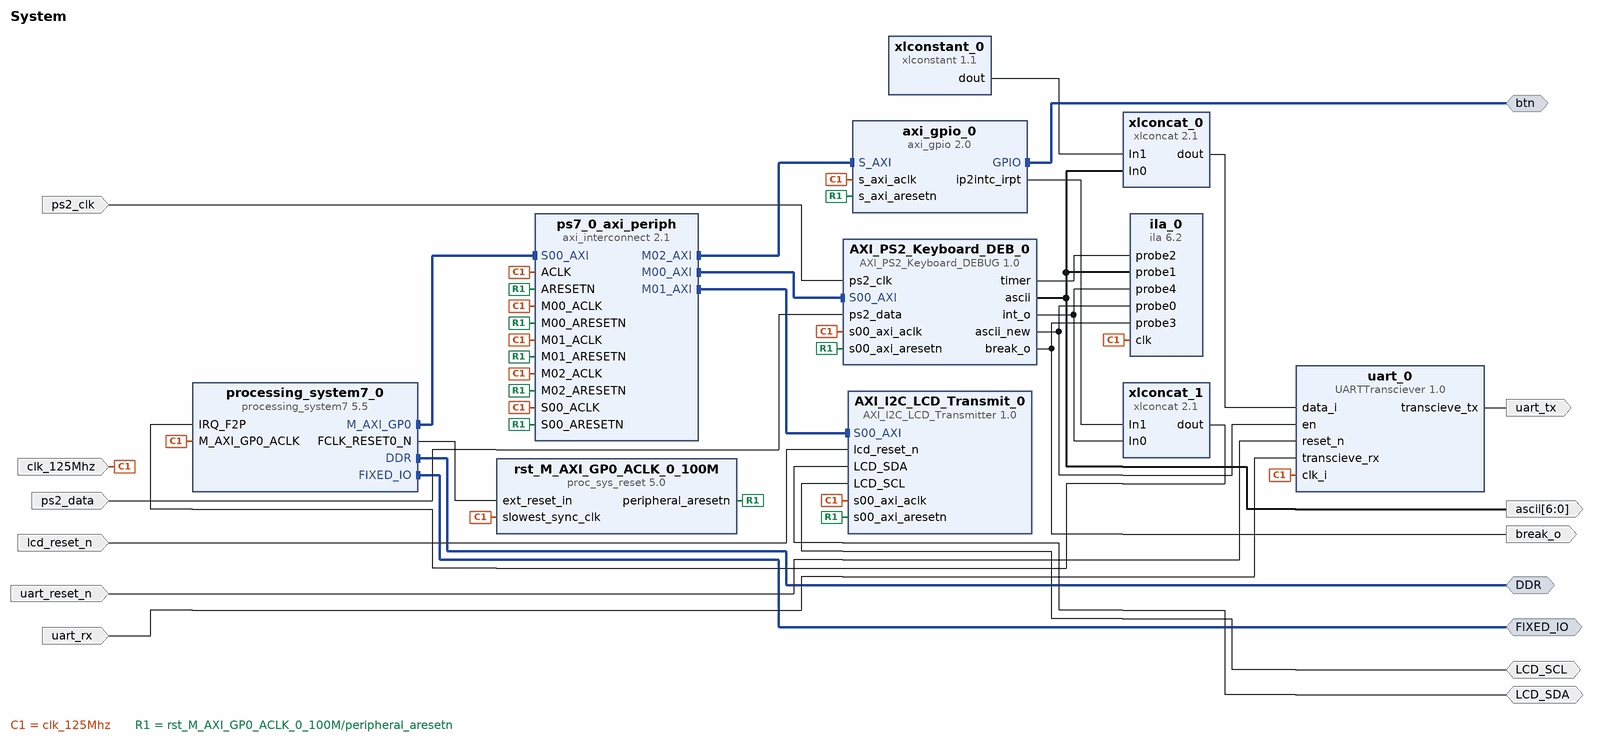
[diagram p0: block diagram of the top level]
# Vivado block design System, xc7z020clg400-1, Vivado 2022.1.2
create_bd_design System

create_bd_intf_port -mode Master -vlnv xilinx.com:interface:ddrx_rtl:1.0 DDR
create_bd_intf_port -mode Master -vlnv xilinx.com:display_processing_system7:fixedio_rtl:1.0 FIXED_IO
create_bd_intf_port -mode Master -vlnv xilinx.com:interface:gpio_rtl:1.0 btn
create_bd_port -dir I ps2_clk
create_bd_port -dir I ps2_data
create_bd_port -dir I -type clk clk_125Mhz
set_property -dict {CONFIG.FREQ_HZ 125000000} [get_bd_ports clk_125Mhz]
create_bd_port -dir I uart_reset_n
create_bd_port -dir I uart_rx
create_bd_port -dir O uart_tx
create_bd_port -dir I lcd_reset_n
create_bd_port -dir IO LCD_SDA
create_bd_port -dir IO LCD_SCL
create_bd_port -dir O break_o
create_bd_port -dir O -from 6 -to 0 ascii

create_bd_cell -type ip -vlnv xilinx.com:ip:processing_system7:5.5 processing_system7_0
set_property -dict [list \
  CONFIG.PCW_APU_PERIPHERAL_FREQMHZ 667 \
  CONFIG.PCW_ENET0_ENET0_IO {MIO 16 .. 27} \
  CONFIG.PCW_ENET0_GRP_MDIO_ENABLE 1 \
  CONFIG.PCW_ENET0_GRP_MDIO_IO {MIO 52 .. 53} \
  CONFIG.PCW_ENET0_PERIPHERAL_ENABLE 1 \
  CONFIG.PCW_ENET0_RESET_ENABLE 0 \
  CONFIG.PCW_ENET_RESET_ENABLE 1 \
  CONFIG.PCW_ENET_RESET_SELECT {Share reset pin} \
  CONFIG.PCW_GPIO_MIO_GPIO_ENABLE 1 \
  CONFIG.PCW_GPIO_MIO_GPIO_IO MIO \
  CONFIG.PCW_I2C_RESET_ENABLE 0 \
  CONFIG.PCW_IRQ_F2P_INTR 1 \
  CONFIG.PCW_PRESET_BANK1_VOLTAGE {LVCMOS 1.8V} \
  CONFIG.PCW_QSPI_GRP_FBCLK_ENABLE 1 \
  CONFIG.PCW_QSPI_GRP_FBCLK_IO {MIO 8} \
  CONFIG.PCW_QSPI_GRP_SINGLE_SS_ENABLE 1 \
  CONFIG.PCW_QSPI_GRP_SINGLE_SS_IO {MIO 1 .. 6} \
  CONFIG.PCW_QSPI_PERIPHERAL_ENABLE 1 \
  CONFIG.PCW_QSPI_QSPI_IO {MIO 1 .. 6} \
  CONFIG.PCW_SD0_GRP_CD_ENABLE 1 \
  CONFIG.PCW_SD0_GRP_CD_IO {MIO 47} \
  CONFIG.PCW_SD0_GRP_WP_ENABLE 0 \
  CONFIG.PCW_SD0_PERIPHERAL_ENABLE 1 \
  CONFIG.PCW_SD0_SD0_IO {MIO 40 .. 45} \
  CONFIG.PCW_SDIO_PERIPHERAL_FREQMHZ 50 \
  CONFIG.PCW_SINGLE_QSPI_DATA_MODE x4 \
  CONFIG.PCW_UART1_PERIPHERAL_ENABLE 1 \
  CONFIG.PCW_UART1_UART1_IO {MIO 48 .. 49} \
  CONFIG.PCW_UART_PERIPHERAL_FREQMHZ 100 \
  CONFIG.PCW_UIPARAM_DDR_FREQ_MHZ 533.333333 \
  CONFIG.PCW_UIPARAM_DDR_MEMORY_TYPE {DDR 3 (Low Voltage)} \
  CONFIG.PCW_UIPARAM_DDR_PARTNO {MT41K256M16 RE-125} \
  CONFIG.PCW_USB0_PERIPHERAL_ENABLE 1 \
  CONFIG.PCW_USB0_RESET_ENABLE 1 \
  CONFIG.PCW_USB0_RESET_IO {MIO 46} \
  CONFIG.PCW_USB0_USB0_IO {MIO 28 .. 39} \
  CONFIG.PCW_USB_RESET_ENABLE 1 \
  CONFIG.PCW_USB_RESET_SELECT {Share reset pin} \
  CONFIG.PCW_USE_FABRIC_INTERRUPT 1 \
] [get_bd_cells processing_system7_0]
# 296 more settings of processing_system7_0 are not shown: defaults, MIO pin electricals, DDR timing, and values the tool derives
create_bd_cell -type ip -vlnv xilinx.com:ip:axi_interconnect:2.1 ps7_0_axi_periph
set_property -dict {CONFIG.NUM_MI 3} [get_bd_cells ps7_0_axi_periph]
create_bd_cell -type ip -vlnv xilinx.com:ip:proc_sys_reset:5.0 rst_M_AXI_GP0_ACLK_0_100M
create_bd_cell -type ip -vlnv empyrea.dev:SerialCommunication:UARTTransciever:1.0 uart_0
set_property -dict {CONFIG.baud_rate 115200 CONFIG.clk_freq 125000000 CONFIG.os_rate 8 CONFIG.parity 0} [get_bd_cells uart_0]
create_bd_cell -type ip -vlnv xilinx.com:ip:xlconcat:2.1 xlconcat_0
create_bd_cell -type ip -vlnv xilinx.com:ip:xlconstant:1.1 xlconstant_0
set_property -dict {CONFIG.CONST_VAL 0} [get_bd_cells xlconstant_0]
create_bd_cell -type ip -vlnv xilinx.com:ip:axi_gpio:2.0 axi_gpio_0
set_property -dict {CONFIG.C_ALL_INPUTS 1 CONFIG.C_GPIO_WIDTH 4 CONFIG.C_INTERRUPT_PRESENT 1} [get_bd_cells axi_gpio_0]
create_bd_cell -type ip -vlnv xilinx.com:ip:xlconcat:2.1 xlconcat_1
create_bd_cell -type ip -vlnv xilinx.com:ip:ila:6.2 ila_0
set_property -dict {CONFIG.C_ENABLE_ILA_AXI_MON false CONFIG.C_MONITOR_TYPE Native CONFIG.C_NUM_OF_PROBES 5} [get_bd_cells ila_0]
create_bd_cell -type ip -vlnv empyrea.dev:AXICommunication:AXI_I2C_LCD_Transmitter:1.0 AXI_I2C_LCD_Transmit_0
create_bd_cell -type ip -vlnv empyrea.dev:AXICommunications:AXI_PS2_Keyboard_DEBUG:1.0 AXI_PS2_Keyboard_DEB_0
set_property -dict {CONFIG.PS2_CLK_FREQ 125000000 CONFIG.TIMER_CLOCK_DIVIDER 6250} [get_bd_cells AXI_PS2_Keyboard_DEB_0]

# ---- connections ----

connect_bd_intf_net [get_bd_intf_ports btn] [get_bd_intf_pins axi_gpio_0/GPIO]
connect_bd_intf_net [get_bd_intf_ports DDR] [get_bd_intf_pins processing_system7_0/DDR]
connect_bd_intf_net [get_bd_intf_ports FIXED_IO] [get_bd_intf_pins processing_system7_0/FIXED_IO]
connect_bd_intf_net [get_bd_intf_pins processing_system7_0/M_AXI_GP0] [get_bd_intf_pins ps7_0_axi_periph/S00_AXI]
connect_bd_intf_net [get_bd_intf_pins ps7_0_axi_periph/M00_AXI] [get_bd_intf_pins AXI_PS2_Keyboard_DEB_0/S00_AXI]
connect_bd_intf_net [get_bd_intf_pins ps7_0_axi_periph/M01_AXI] [get_bd_intf_pins AXI_I2C_LCD_Transmit_0/S00_AXI]
connect_bd_intf_net [get_bd_intf_pins ps7_0_axi_periph/M02_AXI] [get_bd_intf_pins axi_gpio_0/S_AXI]
connect_bd_net [get_bd_pins AXI_PS2_Keyboard_DEB_0/ascii] [get_bd_pins xlconcat_0/In0] [get_bd_ports ascii] [get_bd_pins ila_0/probe1]
connect_bd_net [get_bd_pins AXI_PS2_Keyboard_DEB_0/ascii_new] [get_bd_pins uart_0/en] [get_bd_pins ila_0/probe0]
connect_bd_net [get_bd_pins AXI_PS2_Keyboard_DEB_0/break_o] [get_bd_ports break_o] [get_bd_pins ila_0/probe3]
connect_bd_net [get_bd_pins AXI_PS2_Keyboard_DEB_0/int_o] [get_bd_pins xlconcat_1/In0] [get_bd_pins ila_0/probe4]
connect_bd_net [get_bd_pins AXI_PS2_Keyboard_DEB_0/timer] [get_bd_pins ila_0/probe2]
connect_bd_net -net M_AXI_GP0_ACLK_0_1 [get_bd_ports clk_125Mhz] \
  [get_bd_pins processing_system7_0/M_AXI_GP0_ACLK] [get_bd_pins ps7_0_axi_periph/ACLK] \
  [get_bd_pins ps7_0_axi_periph/S00_ACLK] [get_bd_pins rst_M_AXI_GP0_ACLK_0_100M/slowest_sync_clk] \
  [get_bd_pins ps7_0_axi_periph/M00_ACLK] [get_bd_pins uart_0/clk_i] [get_bd_pins ps7_0_axi_periph/M01_ACLK] \
  [get_bd_pins axi_gpio_0/s_axi_aclk] [get_bd_pins ps7_0_axi_periph/M02_ACLK] [get_bd_pins ila_0/clk] \
  [get_bd_pins AXI_I2C_LCD_Transmit_0/s00_axi_aclk] [get_bd_pins AXI_PS2_Keyboard_DEB_0/s00_axi_aclk]
connect_bd_net [get_bd_ports LCD_SDA] [get_bd_pins AXI_I2C_LCD_Transmit_0/LCD_SDA]
connect_bd_net [get_bd_ports LCD_SCL] [get_bd_pins AXI_I2C_LCD_Transmit_0/LCD_SCL]
connect_bd_net [get_bd_pins axi_gpio_0/ip2intc_irpt] [get_bd_pins xlconcat_1/In1]
connect_bd_net -net lcd_reset_n_0_1 [get_bd_ports lcd_reset_n] [get_bd_pins AXI_I2C_LCD_Transmit_0/lcd_reset_n]
connect_bd_net [get_bd_pins processing_system7_0/FCLK_RESET0_N] [get_bd_pins rst_M_AXI_GP0_ACLK_0_100M/ext_reset_in]
connect_bd_net [get_bd_ports ps2_clk] [get_bd_pins AXI_PS2_Keyboard_DEB_0/ps2_clk]
connect_bd_net [get_bd_ports ps2_data] [get_bd_pins AXI_PS2_Keyboard_DEB_0/ps2_data]
connect_bd_net -net reset_n_0_1 [get_bd_ports uart_reset_n] [get_bd_pins uart_0/reset_n]
connect_bd_net [get_bd_pins rst_M_AXI_GP0_ACLK_0_100M/peripheral_aresetn] \
  [get_bd_pins ps7_0_axi_periph/S00_ARESETN] [get_bd_pins ps7_0_axi_periph/M00_ARESETN] \
  [get_bd_pins ps7_0_axi_periph/ARESETN] [get_bd_pins ps7_0_axi_periph/M01_ARESETN] [get_bd_pins axi_gpio_0/s_axi_aresetn] \
  [get_bd_pins ps7_0_axi_periph/M02_ARESETN] [get_bd_pins AXI_I2C_LCD_Transmit_0/s00_axi_aresetn] \
  [get_bd_pins AXI_PS2_Keyboard_DEB_0/s00_axi_aresetn]
connect_bd_net -net transcieve_rx_0_1 [get_bd_ports uart_rx] [get_bd_pins uart_0/transcieve_rx]
connect_bd_net [get_bd_pins uart_0/transcieve_tx] [get_bd_ports uart_tx]
connect_bd_net [get_bd_pins xlconcat_0/dout] [get_bd_pins uart_0/data_i]
connect_bd_net [get_bd_pins xlconcat_1/dout] [get_bd_pins processing_system7_0/IRQ_F2P]
connect_bd_net [get_bd_pins xlconstant_0/dout] [get_bd_pins xlconcat_0/In1]

# ---- address map ----
assign_bd_address -offset 0x41200000 -range 64K -target_address_space [get_bd_addr_spaces processing_system7_0/Data] [get_bd_addr_segs axi_gpio_0/S_AXI/Reg]
assign_bd_address -offset 0x43C00000 -range 64K -target_address_space [get_bd_addr_spaces processing_system7_0/Data] [get_bd_addr_segs AXI_PS2_Keyboard_DEB_0/S00_AXI/S00_AXI_reg]
assign_bd_address -offset 0x43C10000 -range 64K -target_address_space [get_bd_addr_spaces processing_system7_0/Data] [get_bd_addr_segs AXI_I2C_LCD_Transmit_0/S00_AXI/S00_AXI_reg]

validate_bd_design
save_bd_design
